# EasyEDA schematic Carte Logique V1.json
TITLE: AIO mère; REV: 1.0; Date: 2022-09-17; Sheet: 1/1; Drawn By: Fizzi_; Company: GameTeam 2023
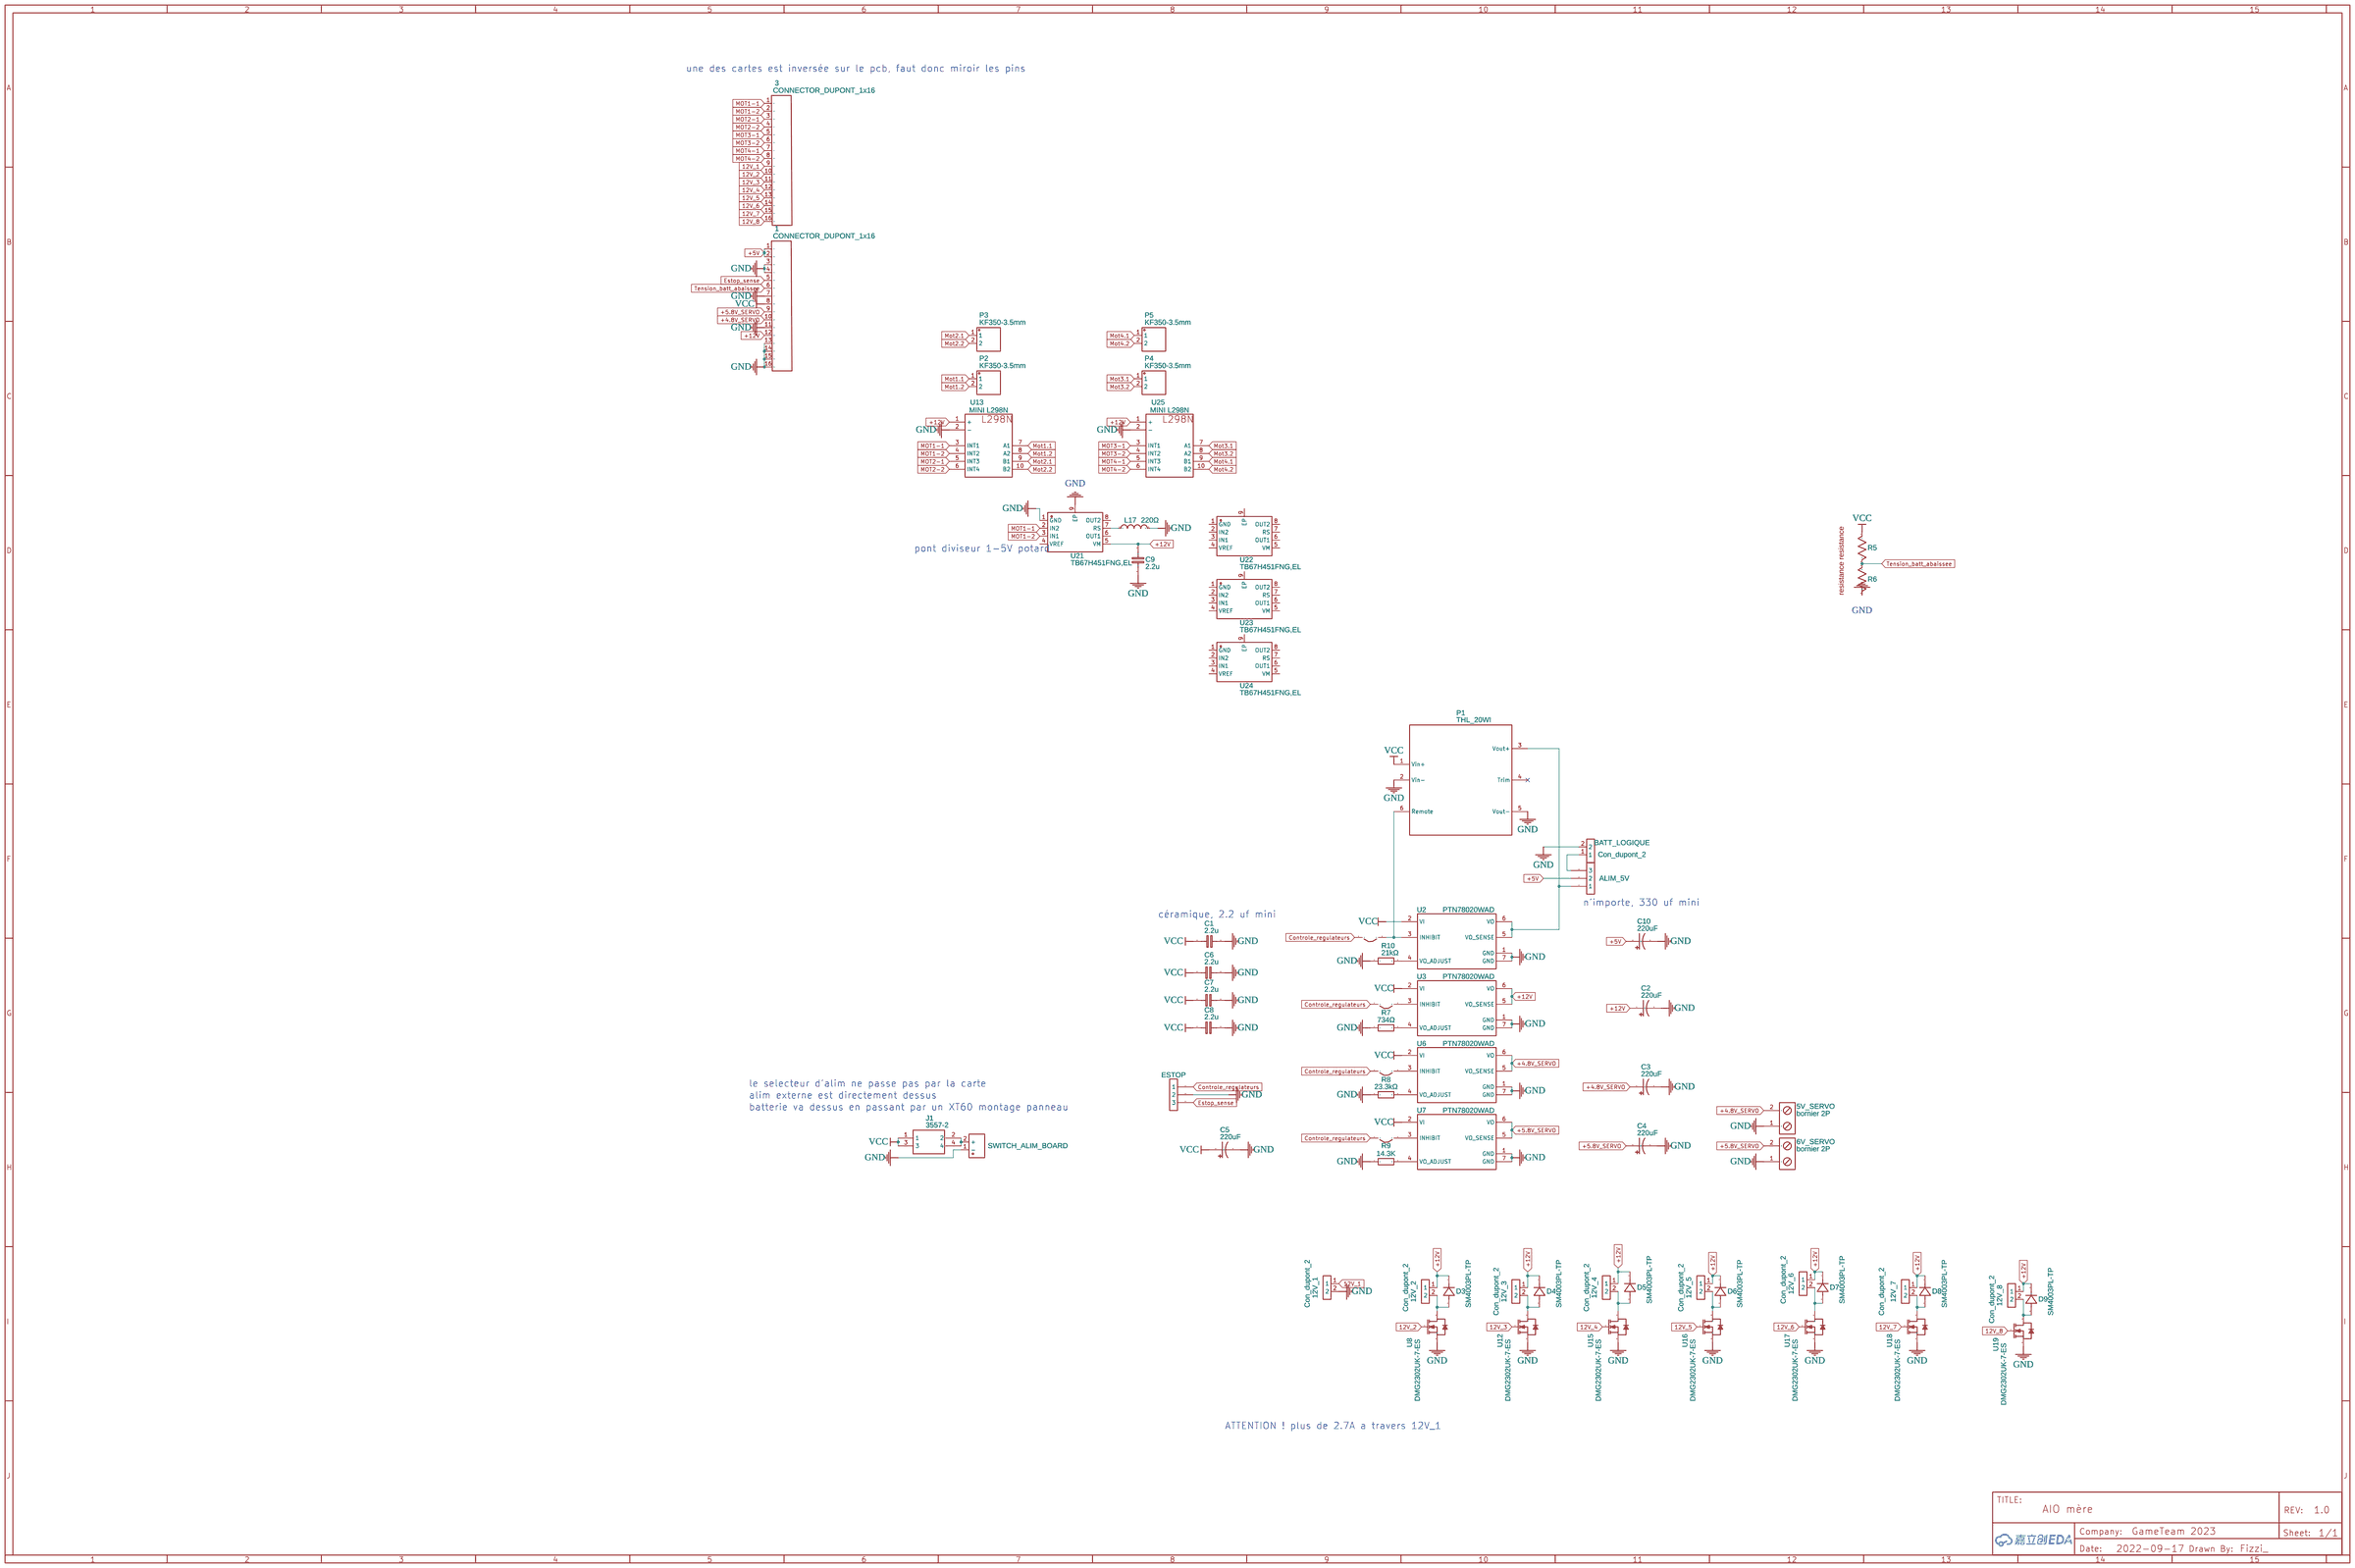
[diagram p0: schematic sheet]

## Parts
1  CONNECTOR_DUPONT_1x16  [DUPONT_16]
3  CONNECTOR_DUPONT_1x16  [DUPONT_16]
5V_SERVO  bornier 2P  [BORNIER 2P]
6V_SERVO  bornier 2P  [BORNIER 2P]
12V_1  Con_dupont_2  [CON_DUPONT_2]
12V_2  Con_dupont_2  [CON_DUPONT_2]
12V_3  Con_dupont_2  [CON_DUPONT_2]
12V_4  Con_dupont_2  [CON_DUPONT_2]
12V_5  Con_dupont_2  [CON_DUPONT_2]
12V_6  Con_dupont_2  [CON_DUPONT_2]
12V_7  Con_dupont_2  [CON_DUPONT_2]
12V_8  Con_dupont_2  [CON_DUPONT_2]
ALIM_5V  Dupont 3Pin  [DUPONT_3PTS]
BATT_LOGIQUE  Con_dupont_2  [CON_DUPONT_2]
C1  2.2u  [C0805]
C2  220uF  [CAP-SMD_BD10.0-L10.3-W10.3-FD]
C3  220uF  [CAP-SMD_BD10.0-L10.3-W10.3-FD]
C4  220uF  [CAP-SMD_BD10.0-L10.3-W10.3-FD]
C5  220uF  [CAP-SMD_BD10.0-L10.3-W10.3-FD]
C6  2.2u  [C0805]
C7  2.2u  [C0805]
C8  2.2u  [C0805]
C9  2.2u  [C0805]
C10  220uF  [CAP-SMD_BD10.0-L10.3-W10.3-FD]
D3  SM4003PL-TP  [SOD-123FL_L2.8-W1.7-LS3.6-RD]
D4  SM4003PL-TP  [SOD-123FL_L2.8-W1.7-LS3.6-RD]
D5  SM4003PL-TP  [SOD-123FL_L2.8-W1.7-LS3.6-RD]
D6  SM4003PL-TP  [SOD-123FL_L2.8-W1.7-LS3.6-RD]
D7  SM4003PL-TP  [SOD-123FL_L2.8-W1.7-LS3.6-RD]
D8  SM4003PL-TP  [SOD-123FL_L2.8-W1.7-LS3.6-RD]
D9  SM4003PL-TP  [SOD-123FL_L2.8-W1.7-LS3.6-RD]
ESTOP  Dupont 3Pin  [DUPONT_3PTS]
J1  3557-2  [3557-2]
JP8  Jumper  [SOLDERJUMPER]
JP9  Jumper  [SOLDERJUMPER]
JP10  Jumper  [SOLDERJUMPER]
JP11  Jumper  [SOLDERJUMPER]
L17  220Ω  [L0603]
P1  THL_20WI  [THL 20WI]
P2  KF350-3.5mm  [KF350-2P]
P3  KF350-3.5mm  [KF350-2P]
P4  KF350-3.5mm  [KF350-2P]
P5  KF350-3.5mm  [KF350-2P]
R5  1K  [TROUGH HOLE RESISTOR 12MM]
R6  1K  [TROUGH HOLE RESISTOR 12MM]
R7  734Ω  [R0603]
R8  23.3kΩ  [R0603]
R9  14.3K  [R0603]
R10  21kΩ  [R0603]
SWITCH_ALIM_BOARD  XT60-M  [XT60-M]
U2  PTN78020WAD  [TI-EUK7_V]
U3  PTN78020WAD  [TI-EUK7_V]
U6  PTN78020WAD  [TI-EUK7_V]
U7  PTN78020WAD  [TI-EUK7_V]
U8  DMG2302UK-7-ES  [SOT-23-3_L2.9-W1.3-P1.90-LS2.4-BR]
U12  DMG2302UK-7-ES  [SOT-23-3_L2.9-W1.3-P1.90-LS2.4-BR]
U13  MINI L298N  [MINI-L298N]
U15  DMG2302UK-7-ES  [SOT-23-3_L2.9-W1.3-P1.90-LS2.4-BR]
U16  DMG2302UK-7-ES  [SOT-23-3_L2.9-W1.3-P1.90-LS2.4-BR]
U17  DMG2302UK-7-ES  [SOT-23-3_L2.9-W1.3-P1.90-LS2.4-BR]
U18  DMG2302UK-7-ES  [SOT-23-3_L2.9-W1.3-P1.90-LS2.4-BR]
U19  DMG2302UK-7-ES  [SOT-23-3_L2.9-W1.3-P1.90-LS2.4-BR]
U21  TB67H451FNG,EL  [HSOP-8_L5.0-W4.0-P1.27-LS6.2-BL-EP]
U22  TB67H451FNG,EL  [HSOP-8_L5.0-W4.0-P1.27-LS6.2-BL-EP]
U23  TB67H451FNG,EL  [HSOP-8_L5.0-W4.0-P1.27-LS6.2-BL-EP]
U24  TB67H451FNG,EL  [HSOP-8_L5.0-W4.0-P1.27-LS6.2-BL-EP]
U25  MINI L298N  [MINI-L298N]

## Library data of the parts
1 3 = CONNECTOR_DUPONT_1x16: Contributor: palton01
5V_SERVO 6V_SERVO = bornier 2P: Manufacturer Part: bornier; Contributor: BPAI; Supplier Part: https://fr.aliexpress.com/item/10pcs-2-Poles-2-Pin-2-54mm-0-1-PCB-Universal-Screw-Terminal-Block-Connector-Free/32556311867.html?spm=a2g0s.12269583.0.0.52167213yanoYJ
12V_1-12V_8 BATT_LOGIQUE = Con_dupont_2: Contributor: Christian GILSON
ALIM_5V ESTOP = Dupont 3Pin: Contributor: tomsouthtrader
C1 C6-C9 = C_0805_EU: Contributor: LCEDA_Lib
C2-C5 C10 = EEEFK1H221P: Supplier: LCSC; Supplier Part: C178549; Manufacturer: PANASONIC(松下); Contributor: LCSC; JLCPCB Part Class: Extended Part
D3-D9 = SM4003PL-TP: Supplier: LCSC; Supplier Part: C725472; Manufacturer: MCC(美微科); Contributor: LCSC; JLCPCB Part Class: Extended Part
J1 = 3557-2: Contributor: Stampolidis
JP8-JP11 = Jumper Solder Bridge: Contributor: rutg3r
L17 = BLM18SG221TN1D: Supplier: LCSC; Manufacturer: muRata(村田); Supplier Part: C88988; JLCPCB Part Class: Extended Part
P1 = THL_20WI: Manufacturer: Traco; Contributor: movtar
P2-P5 = KF350-3.5mm: Supplier Part: C8445; Supplier: LCSC; Manufacturer: ReliaPro; Manufacturer Part: WJ2EDGVC-5.08-2P; Contributor: Vitalii Sharaievskyi
R5 R6 = TROUGH HOLE RESISTOR 12MM: Contributor: delvingt.julien
R7 = TR0603D383KP0515: Supplier: LCSC; Supplier Part: C153382; Manufacturer: EVER OHMS(天二科技); Resistance (Ohms): 383K; Contributor: LCSC; JLCPCB Part Class: Extended Part
R8 = 0603WAF2322T5E: Supplier: LCSC; Manufacturer: UNI-ROYAL(厚声); Supplier Part: C23346; Resistance (Ohms): 23.2K; JLCPCB Part Class: Extended Part
R9 = AC0603FR-0714K3L: Supplier: LCSC; Supplier Part: C227592; Manufacturer: YAGEO(国巨); Contributor: LCSC; JLCPCB Part Class: Extended Part; Resistance: 14.3kΩ
R10 = HPCR0603F21K0K9: Supplier: LCSC; Supplier Part: C365119; Manufacturer: RESI(开步睿思）; Resistance (Ohms): 21K; Contributor: LCSC; JLCPCB Part Class: Extended Part
SWITCH_ALIM_BOARD = XT60-M: Supplier: LCSC; Supplier Part: C2918078; Manufacturer Part: XT60UPB-M; JLCPCB Part Class: Extended Part; Contributor: LCSC
U2 U3 U6 U7 = PTN78020WAD: 6 A Wide-Input Voltage Adjustable Switching Regulator, -40 to 85 degC, 7-pin Module (EUK7), Pb-Free (RoHS)
U8 U12 U15-U19 = DMG2302UK-7-ES: Supplier: LCSC; Supplier Part: C5224188; Manufacturer: ElecSuper(静芯微）; link: https://atta.szlcsc.com/upload/public/pdf/source/20221027/3B58269FFD7C778AC1A1E1303AA6925C.pdf; Contributor: lcsc
U13 U25 = MINI L298N: Contributor: Dezcript
U21-U24 = TB67H451FNG,EL: Supplier: LCSC; Supplier Part: C1858375; Manufacturer: TOSHIBA(东芝); Contributor: LCSC; JLCPCB Part Class: Extended Part

## Nets
12V_1: 3.9 12V_1.1
12V_2: 3.10 U8.1(G)
12V_3: 3.11 U12.1(G)
12V_4: 3.12 U15.1(G)
12V_5: 3.13 U16.1(G)
12V_6: 3.14 U17.1(G)
12V_7: 3.15 U18.1(G)
12V_8: 3.16 U19.1(G)
+4.8V_SERVO: 1.10 5V_SERVO.2 C3.1 U6.5(VO SENSE) U6.6(VO)
+5.8V_SERVO: 1.9 6V_SERVO.2 C4.1 U7.5(VO SENSE) U7.6(VO)
+5V: 1.1 1.2 ALIM_5V.2 C10.1
+12V: 1.12 12V_2.1 12V_3.1 12V_4.1 12V_5.1 12V_6.1 12V_7.1 12V_8.1 C2.1 C9.2 D3.1(K) D4.1(K) D5.1(K) D6.1(K) D7.1(K) D8.1(K) D9.1(K) U3.5(VO SENSE) U3.6(VO) U13.1(+) U21.5(VM) U25.1(+)
GND: 1.3 1.4 1.7 1.11 1.13 1.14 1.15 1.16 5V_SERVO.1 6V_SERVO.1 12V_1.2 BATT_LOGIQUE.2 C1.1 C2.2 C3.2 C4.2 C5.2 C6.2 C7.2 C8.2 C9.1 C10.2 ESTOP.2 L17.2 P1.2(Vin-) P1.5(Vout-) R6.2 R7.1 R8.1 R9.1 R10.1 SWITCH_ALIM_BOARD.1(-) U2.1(GND) U2.7(GND) U3.1(GND) U3.7(GND) U6.1(GND) U6.7(GND) U7.1(GND) U7.7(GND) U8.2(S) U12.2(S) U13.2(-) U15.2(S) U16.2(S) U17.2(S) U18.2(S) U19.2(S) U21.1(GND) U21.9(EP) U25.2(-)
VCC: 1.8 C1.2 C5.1 C6.1 C7.1 C8.1 J1.1 J1.3 P1.1(Vin+) R5.1 U2.2(VI) U3.2(VI) U6.2(VI) U7.2(VI)
Controle_regulateurs: ESTOP.1 JP8.1 JP9.1 JP10.1 JP11.1
Estop_sense: 1.5 ESTOP.3
MOT1-1: 3.1 U13.3(INT1) U21.2(IN2)
MOT1-2: 3.2 U13.4(INT2) U21.3(IN1)
Mot1.1: P2.1 U13.7(A1)
Mot1.2: P2.2 U13.8(A2)
MOT2-1: 3.3 U13.5(INT3)
MOT2-2: 3.4 U13.6(INT4)
Mot2.1: P3.1 U13.9(B1)
Mot2.2: P3.2 U13.10(B2)
MOT3-1: 3.5 U25.3(INT1)
MOT3-2: 3.6 U25.4(INT2)
Mot3.1: P4.1 U25.7(A1)
Mot3.2: P4.2 U25.8(A2)
MOT4-1: 3.7 U25.5(INT3)
MOT4-2: 3.8 U25.6(INT4)
Mot4.1: P5.1 U25.9(B1)
Mot4.2: P5.2 U25.10(B2)
Tension_batt_abaissee: 1.6 R5.2 R6.1
Net-(12V_2-2): 12V_2.2 D3.2(A) U8.3(D)
Net-(12V_3-2): 12V_3.2 D4.2(A) U12.3(D)
Net-(12V_4-2): 12V_4.2 D5.2(A) U15.3(D)
Net-(12V_5-2): 12V_5.2 D6.2(A) U16.3(D)
Net-(12V_6-2): 12V_6.2 D7.2(A) U17.3(D)
Net-(12V_7-2): 12V_7.2 D8.2(A) U18.3(D)
Net-(12V_8-2): 12V_8.2 D9.2(A) U19.3(D)
Net-(ALIM_5V-1): ALIM_5V.1 P1.3(Vout+) U2.5(VO SENSE) U2.6(VO)
Net-(ALIM_5V-3): ALIM_5V.3 BATT_LOGIQUE.1
Net-(J1-2): J1.2 J1.4 SWITCH_ALIM_BOARD.2(+)
Net-(JP8-2): JP8.2 P1.6(Remote) U2.3(INHIBIT)
Net-(JP9-2): JP9.2 U3.3(INHIBIT)
Net-(JP10-2): JP10.2 U6.3(INHIBIT)
Net-(JP11-2): JP11.2 U7.3(INHIBIT)
Net-(L17-1): L17.1 U21.7(RS)
Net-(R7-2): R7.2 U3.4(VO ADJUST)
Net-(R8-2): R8.2 U6.4(VO ADJUST)
Net-(R9-2): R9.2 U7.4(VO ADJUST)
Net-(R10-2): R10.2 U2.4(VO ADJUST)

Not connected (* = marked no-connect by the designer): P1 4(Trim)*; U21 4(VREF) 6(OUT1) 8(OUT2); U22 1(GND) 2(IN2) 3(IN1) 4(VREF) 5(VM) 6(OUT1) 7(RS) 8(OUT2) 9(EP); U23 1(GND) 2(IN2) 3(IN1) 4(VREF) 5(VM) 6(OUT1) 7(RS) 8(OUT2) 9(EP); U24 1(GND) 2(IN2) 3(IN1) 4(VREF) 5(VM) 6(OUT1) 7(RS) 8(OUT2) 9(EP)

## Notes on the sheet
- une des cartes est inversée sur le pcb, faut donc miroir les pins
- pont diviseur 1-5V potard
- n'importe, 330 uf mini
- céramique, 2.2 uf mini
- le selecteur d'alim ne passe pas par la carte
- alim externe est directement dessus
- batterie va dessus en passant par un XT60 montage panneau
- ATTENTION ! plus de 2.7A a travers 12V_1
